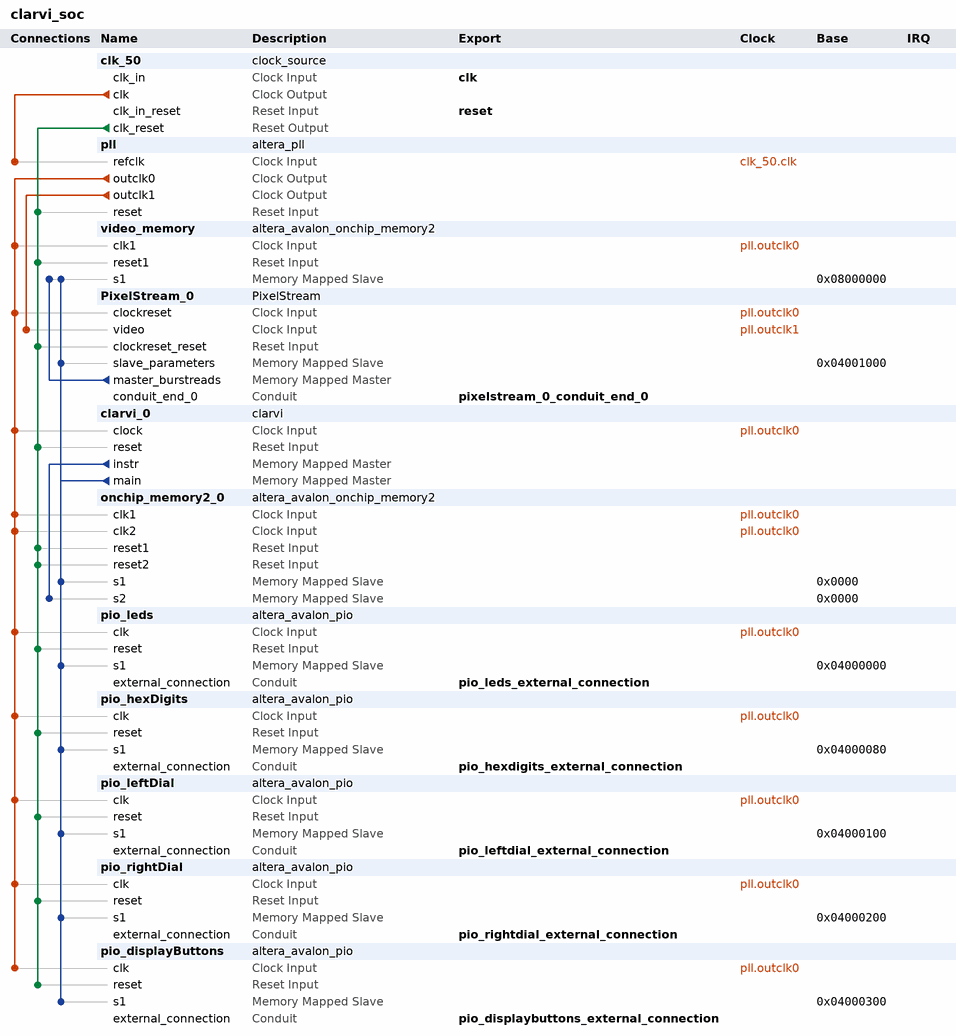
[diagram p0: system contents]
# Platform Designer (Qsys) system clarvi_soc, Cyclone V 5CSEMA5F31C6
# Parameters at their usual value, and those the tool derives, are not listed.
package require -exact qsys 16.1
create_system clarvi_soc
set_project_property DEVICE_FAMILY {Cyclone V}
set_project_property DEVICE 5CSEMA5F31C6

add_instance clk_50 clock_source 16.1
set_instance_parameter_value clk_50 clockFrequency 50000000

add_instance pll altera_pll 16.1
set_instance_parameter_value pll gui_device_speed_grade 2
set_instance_parameter_value pll gui_number_of_clocks 2
set_instance_parameter_value pll gui_operation_mode direct
set_instance_parameter_value pll gui_output_clock_frequency0 50.0
set_instance_parameter_value pll gui_output_clock_frequency1 9.0
set_instance_parameter_value pll gui_pll_mode {Integer-N PLL}
set_instance_parameter_value pll gui_reference_clock_frequency 50.0
set_instance_parameter_value pll gui_use_locked false

add_instance video_memory altera_avalon_onchip_memory2 16.1
set_instance_parameter_value video_memory dataWidth 32
set_instance_parameter_value video_memory dualPort false
set_instance_parameter_value video_memory initMemContent false
set_instance_parameter_value video_memory initializationFileName onchip_mem.hex
set_instance_parameter_value video_memory memorySize 261120

add_instance PixelStream_0 PixelStream 1.0

add_instance clarvi_0 clarvi 1.0
set_instance_parameter_value clarvi_0 DATA_ADDR_WIDTH 29
set_instance_parameter_value clarvi_0 DEFAULT_TRAP_VECTOR 0
set_instance_parameter_value clarvi_0 INITIAL_PC 0
set_instance_parameter_value clarvi_0 INSTR_ADDR_WIDTH 14

add_instance onchip_memory2_0 altera_avalon_onchip_memory2 16.1
set_instance_parameter_value onchip_memory2_0 dataWidth 32
set_instance_parameter_value onchip_memory2_0 dualPort true
set_instance_parameter_value onchip_memory2_0 initMemContent true
set_instance_parameter_value onchip_memory2_0 initializationFileName /home/ecad/Desktop/exercise5/software/build/mem.hex
set_instance_parameter_value onchip_memory2_0 memorySize 65536
set_instance_parameter_value onchip_memory2_0 useNonDefaultInitFile true

add_instance pio_leds altera_avalon_pio 16.1
set_instance_parameter_value pio_leds direction Output
set_instance_parameter_value pio_leds width 10

add_instance pio_hexDigits altera_avalon_pio 16.1
set_instance_parameter_value pio_hexDigits direction Output
set_instance_parameter_value pio_hexDigits width 24

add_instance pio_leftDial altera_avalon_pio 16.1
set_instance_parameter_value pio_leftDial direction Input
set_instance_parameter_value pio_leftDial width 8

add_instance pio_rightDial altera_avalon_pio 16.1
set_instance_parameter_value pio_rightDial direction Input
set_instance_parameter_value pio_rightDial width 8

add_instance pio_displayButtons altera_avalon_pio 16.1
set_instance_parameter_value pio_displayButtons direction Input
set_instance_parameter_value pio_displayButtons width 16

# connections
add_connection clk_50.clk pll.refclk clock
add_connection pll.outclk0 clarvi_0.clock clock
add_connection pll.outclk0 onchip_memory2_0.clk1 clock
add_connection pll.outclk0 onchip_memory2_0.clk2 clock
add_connection pll.outclk0 pio_displayButtons.clk clock
add_connection pll.outclk0 pio_hexDigits.clk clock
add_connection pll.outclk0 pio_leds.clk clock
add_connection pll.outclk0 pio_leftDial.clk clock
add_connection pll.outclk0 pio_rightDial.clk clock
add_connection pll.outclk0 PixelStream_0.clockreset clock
add_connection pll.outclk0 video_memory.clk1 clock
add_connection pll.outclk1 PixelStream_0.video clock
add_connection clk_50.clk_reset clarvi_0.reset reset
add_connection clk_50.clk_reset onchip_memory2_0.reset1 reset
add_connection clk_50.clk_reset onchip_memory2_0.reset2 reset
add_connection clk_50.clk_reset pio_displayButtons.reset reset
add_connection clk_50.clk_reset pio_hexDigits.reset reset
add_connection clk_50.clk_reset pio_leds.reset reset
add_connection clk_50.clk_reset pio_leftDial.reset reset
add_connection clk_50.clk_reset pio_rightDial.reset reset
add_connection clk_50.clk_reset PixelStream_0.clockreset_reset reset
add_connection clk_50.clk_reset pll.reset reset
add_connection clk_50.clk_reset video_memory.reset1 reset
add_connection clarvi_0.instr onchip_memory2_0.s2 avalon
set_connection_parameter_value clarvi_0.instr/onchip_memory2_0.s2 baseAddress 0x0000
add_connection clarvi_0.main onchip_memory2_0.s1 avalon
set_connection_parameter_value clarvi_0.main/onchip_memory2_0.s1 baseAddress 0x0000
add_connection clarvi_0.main pio_displayButtons.s1 avalon
set_connection_parameter_value clarvi_0.main/pio_displayButtons.s1 baseAddress 0x04000300
add_connection clarvi_0.main pio_hexDigits.s1 avalon
set_connection_parameter_value clarvi_0.main/pio_hexDigits.s1 baseAddress 0x04000080
add_connection clarvi_0.main pio_leds.s1 avalon
set_connection_parameter_value clarvi_0.main/pio_leds.s1 baseAddress 0x04000000
add_connection clarvi_0.main pio_leftDial.s1 avalon
set_connection_parameter_value clarvi_0.main/pio_leftDial.s1 baseAddress 0x04000100
add_connection clarvi_0.main pio_rightDial.s1 avalon
set_connection_parameter_value clarvi_0.main/pio_rightDial.s1 baseAddress 0x04000200
add_connection clarvi_0.main PixelStream_0.slave_parameters avalon
set_connection_parameter_value clarvi_0.main/PixelStream_0.slave_parameters baseAddress 0x04001000
add_connection clarvi_0.main video_memory.s1 avalon
set_connection_parameter_value clarvi_0.main/video_memory.s1 baseAddress 0x08000000
add_connection PixelStream_0.master_burstreads video_memory.s1 avalon
set_connection_parameter_value PixelStream_0.master_burstreads/video_memory.s1 baseAddress 0x08000000

# exported interfaces
add_interface clk clock sink
set_interface_property clk EXPORT_OF clk_50.clk_in
add_interface pio_displaybuttons_external_connection conduit end
set_interface_property pio_displaybuttons_external_connection EXPORT_OF pio_displayButtons.external_connection
add_interface pio_hexdigits_external_connection conduit end
set_interface_property pio_hexdigits_external_connection EXPORT_OF pio_hexDigits.external_connection
add_interface pio_leds_external_connection conduit end
set_interface_property pio_leds_external_connection EXPORT_OF pio_leds.external_connection
add_interface pio_leftdial_external_connection conduit end
set_interface_property pio_leftdial_external_connection EXPORT_OF pio_leftDial.external_connection
add_interface pio_rightdial_external_connection conduit end
set_interface_property pio_rightdial_external_connection EXPORT_OF pio_rightDial.external_connection
add_interface pixelstream_0_conduit_end_0 conduit end
set_interface_property pixelstream_0_conduit_end_0 EXPORT_OF PixelStream_0.conduit_end_0
add_interface reset reset sink
set_interface_property reset EXPORT_OF clk_50.clk_in_reset

set_interconnect_requirement {$system} qsys_mm.clockCrossingAdapter HANDSHAKE
set_interconnect_requirement {$system} qsys_mm.enableEccProtection FALSE
set_interconnect_requirement {$system} qsys_mm.insertDefaultSlave FALSE
set_interconnect_requirement {$system} qsys_mm.maxAdditionalLatency 1

save_system clarvi_soc.qsys
